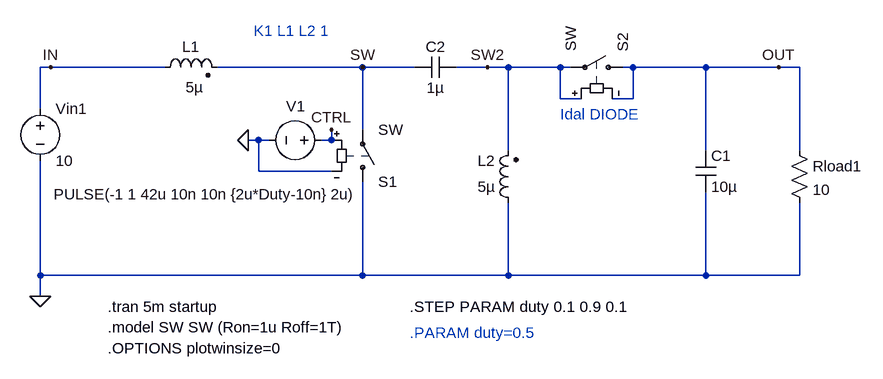
[diagram p0: schematic Fig_7-30_SEPIC_Ideal_Duty-STEP.asc]
Fig_7-30_SEPIC_Ideal_Duty-STEP.asc, the LTspice schematic file:
Version 4
SHEET 1 880 680
WIRE -992 -448 -1008 -448
WIRE -816 -448 -992 -448
WIRE -512 -448 -736 -448
WIRE -432 -448 -512 -448
WIRE -320 -448 -368 -448
WIRE -288 -448 -320 -448
WIRE -208 -448 -288 -448
WIRE -192 -448 -208 -448
WIRE -96 -448 -112 -448
WIRE 16 -448 -96 -448
WIRE 128 -448 16 -448
WIRE 160 -448 128 -448
WIRE -208 -400 -208 -448
WIRE -176 -400 -208 -400
WIRE -96 -400 -96 -448
WIRE -96 -400 -128 -400
WIRE -1008 -384 -1008 -448
WIRE -512 -352 -512 -448
WIRE -672 -336 -688 -336
WIRE -656 -336 -672 -336
WIRE -560 -336 -560 -352
WIRE -560 -336 -576 -336
WIRE -288 -320 -288 -448
WIRE 16 -320 16 -448
WIRE 160 -320 160 -448
WIRE -672 -288 -672 -336
WIRE -560 -288 -672 -288
WIRE -1008 -128 -1008 -304
WIRE -512 -128 -512 -272
WIRE -512 -128 -1008 -128
WIRE -288 -128 -288 -240
WIRE -288 -128 -512 -128
WIRE 16 -128 16 -256
WIRE 16 -128 -288 -128
WIRE 160 -128 160 -240
WIRE 160 -128 16 -128
WIRE -1008 -96 -1008 -128
FLAG -1008 -96 0
FLAG 128 -448 OUT
FLAG -992 -448 IN
FLAG -512 -448 SW
FLAG -560 -352 CTRL
FLAG -688 -336 0
FLAG -320 -448 SW2
SYMBOL sw -512 -256 M180
SYMATTR InstName S1
SYMBOL ind2 -832 -432 R270
WINDOW 0 32 56 VTop 2
WINDOW 3 1 61 VBottom 2
SYMATTR InstName L1
SYMATTR Value 5µ
SYMATTR Type ind
SYMBOL cap 0 -320 R0
SYMATTR InstName C1
SYMATTR Value 10µ
SYMBOL voltage -1008 -400 R0
WINDOW 123 0 0 Left 2
WINDOW 39 0 0 Left 2
SYMATTR InstName Vin1
SYMATTR Value 10
SYMBOL voltage -560 -336 M270
WINDOW 123 0 0 Left 2
WINDOW 39 0 0 Left 2
WINDOW 0 52 40 VRight 2
WINDOW 3 -83 -42 VRight 2
SYMATTR InstName V1
SYMATTR Value PULSE(-1 1 42u 10n 10n {2u*Duty-10n} 2u)
SYMBOL res 144 -336 R0
SYMATTR InstName Rload1
SYMATTR Value 10
SYMBOL sw -96 -448 M270
SYMATTR InstName S2
SYMBOL ind2 -272 -224 R180
WINDOW 0 36 80 Left 2
WINDOW 3 36 40 Left 2
SYMATTR InstName L2
SYMATTR Value 5µ
SYMATTR Type ind
SYMBOL cap -432 -432 R270
WINDOW 0 32 32 VTop 2
WINDOW 3 0 32 VBottom 2
SYMATTR InstName C2
SYMATTR Value 1µ
TEXT -904 -48 Left 2 !.model SW SW (Ron=1u Roff=1T)
TEXT -904 -80 Left 2 !.tran 5m startup
TEXT -440 -80 Left 2 !.STEP PARAM duty 0.1 0.9 0.1
TEXT -208 -376 Left 2 ;Idal DIODE
TEXT -904 -16 Left 2 !.OPTIONS plotwinsize=0
TEXT -680 -504 Left 2 ;K1 L1 L2 1
TEXT -440 -40 Left 2 ;.PARAM duty=0.5

The netlist it stands for:
* Fig_7-30_SEPIC_Ideal_Duty-STEP.asc
S1 0 SW CTRL 0 SW
L1 IN SW 5µ
C1 OUT 0 10µ
Vin1 IN 0 10
V1 CTRL 0 PULSE(-1 1 42u 10n 10n {2u*Duty-10n} 2u)
Rload1 OUT 0 10
S2 OUT SW2 SW2 OUT SW
L2 0 SW2 5µ
C2 SW SW2 1µ
.model SW SW (Ron=1u Roff=1T)
.tran 5m startup
.STEP PARAM duty 0.1 0.9 0.1
* Idal DIODE
.OPTIONS plotwinsize=0
* K1 L1 L2 1
* .PARAM duty=0.5
.backanno
.end